# Altium schematic sheet I2C_Switch.SchDoc
size A3; SheetNumber: 35; SheetTotal: 35
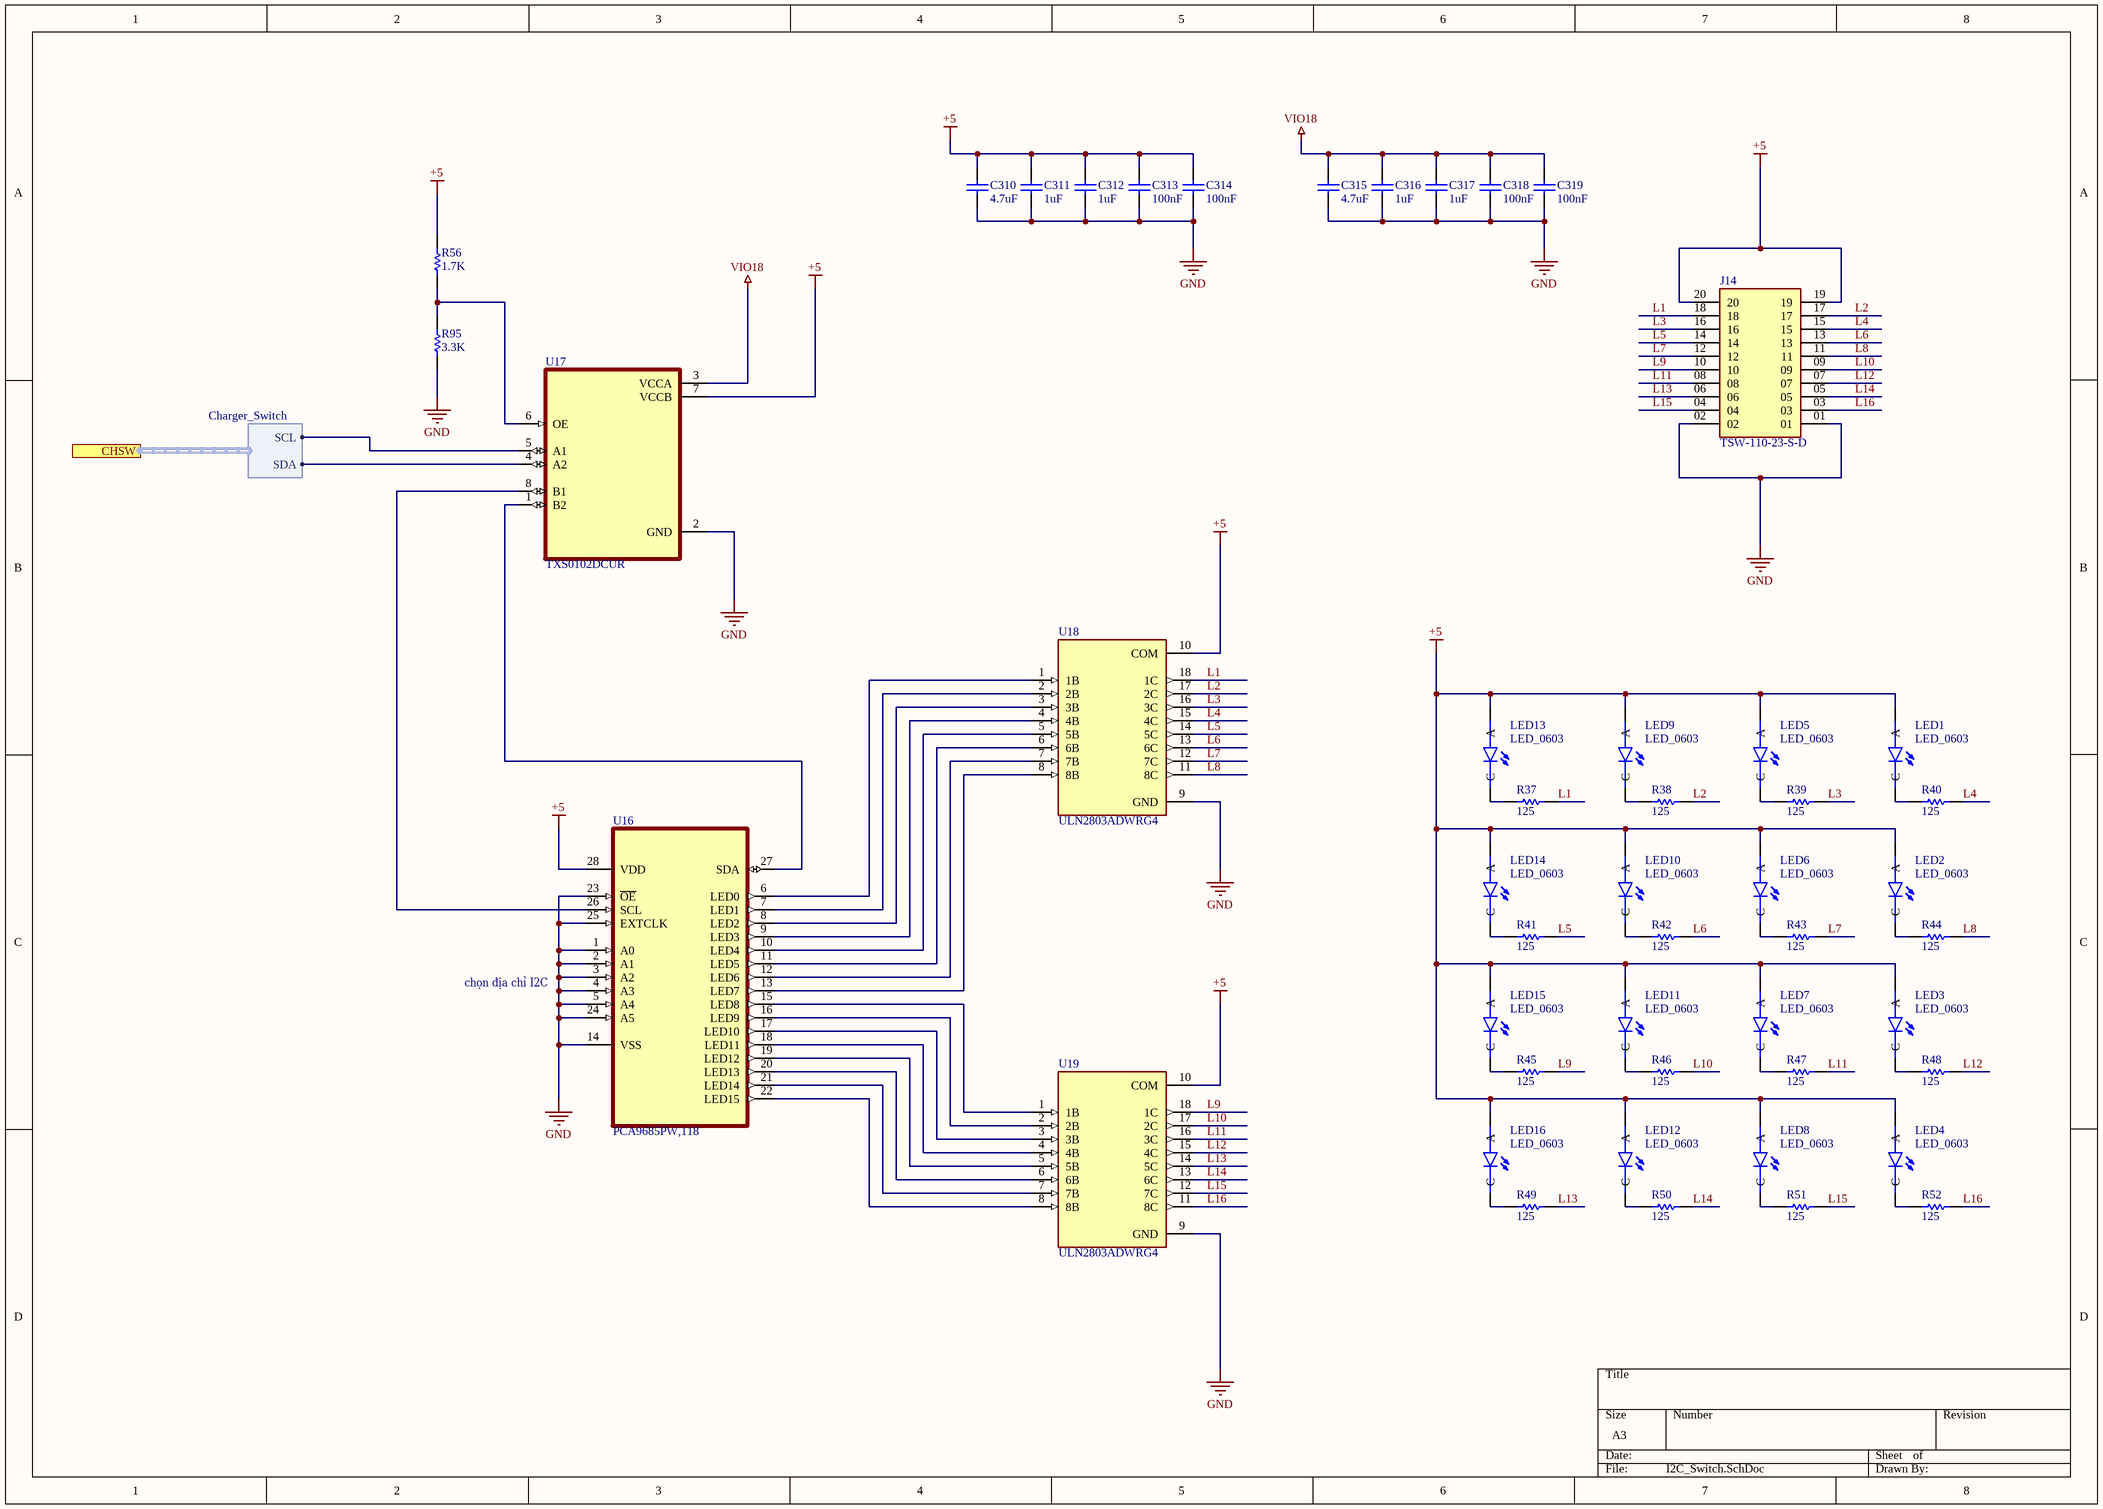
[diagram p0: I2C_Switch.SchDoc]

## Parts
C310  value 4.7uF  [C0805]  (hidden comment: C0805)
C311  value 1uF  [C0805]  (hidden comment: C0805)
C312  value 1uF  [C0805]  (hidden comment: C0805)
C313  value 100nF  [C0603]  (hidden comment: C0603)
C314  value 100nF  [C0603]  (hidden comment: C0603)
C315  value 4.7uF  [C0805]  (hidden comment: C0805)
C316  value 1uF  [C0805]  (hidden comment: C0805)
C317  value 1uF  [C0805]  (hidden comment: C0805)
C318  value 100nF  [C0603]  (hidden comment: C0603)
C319  value 100nF  [C0603]  (hidden comment: C0603)
J14  TSW-110-23-S-D  [SAMTEC_TSW-110-23-S-D]
LED1  LED_0603  [LED_0603]
LED2  LED_0603  [LED_0603]
LED3  LED_0603  [LED_0603]
LED4  LED_0603  [LED_0603]
LED5  LED_0603  [LED_0603]
LED6  LED_0603  [LED_0603]
LED7  LED_0603  [LED_0603]
LED8  LED_0603  [LED_0603]
LED9  LED_0603  [LED_0603]
LED10  LED_0603  [LED_0603]
LED11  LED_0603  [LED_0603]
LED12  LED_0603  [LED_0603]
LED13  LED_0603  [LED_0603]
LED14  LED_0603  [LED_0603]
LED15  LED_0603  [LED_0603]
LED16  LED_0603  [LED_0603]
R37  value 125  [R0603]  (hidden comment: R0603)
R38  value 125  [R0603]  (hidden comment: R0603)
R39  value 125  [R0603]  (hidden comment: R0603)
R40  value 125  [R0603]  (hidden comment: R0603)
R41  value 125  [R0603]  (hidden comment: R0603)
R42  value 125  [R0603]  (hidden comment: R0603)
R43  value 125  [R0603]  (hidden comment: R0603)
R44  value 125  [R0603]  (hidden comment: R0603)
R45  value 125  [R0603]  (hidden comment: R0603)
R46  value 125  [R0603]  (hidden comment: R0603)
R47  value 125  [R0603]  (hidden comment: R0603)
R48  value 125  [R0603]  (hidden comment: R0603)
R49  value 125  [R0603]  (hidden comment: R0603)
R50  value 125  [R0603]  (hidden comment: R0603)
R51  value 125  [R0603]  (hidden comment: R0603)
R52  value 125  [R0603]  (hidden comment: R0603)
R56  value 1.7K  [R0603]  (hidden comment: R0603)
R95  value 3.3K  [R0603]  (hidden comment: R0603)
U16  PCA9685PW,118  [SOP65P640X110-28N]
U17  TXS0102DCUR  [SOP50P310X90-8N]
U18  ULN2803ADWRG4  [SOIC127P1030X265-18N]
U19  ULN2803ADWRG4  [SOIC127P1030X265-18N]

## Ports
CHSW (harness Charger_Switch, see main[8500,1000], Charger_boost_LDO[1400,3400], Power[5300,500])

## Harnesses
Charger_Switch: SCL, SDA

## Nets
+5: C310.2 C311.2 C312.2 C313.2 C314.2 J14.19 J14.20 LED1.A LED2.A LED3.A LED4.A LED5.A LED6.A LED7.A LED8.A LED9.A LED10.A LED11.A LED12.A LED13.A LED14.A LED15.A LED16.A R56.2 U16.28(VDD) U17.7(VCCB) U18.10(COM) U19.10(COM)
GND: C310.1 C311.1 C312.1 C313.1 C314.1 C315.1 C316.1 C317.1 C318.1 C319.1 J14.01 J14.02 R95.1 U16.1(A0) U16.2(A1) U16.3(A2) U16.4(A3) U16.5(A4) U16.14(VSS) U16.23(~{OE}) U16.24(A5) U16.25(EXTCLK) U17.2(GND) U18.9(GND) U19.9(GND)
VIO18: C315.2 C316.2 C317.2 C318.2 C319.2 U17.3(VCCA)
L1: J14.18 R37.2 U18.18(1C)
L2: J14.17 R38.2 U18.17(2C)
L3: J14.16 R39.2 U18.16(3C)
L4: J14.15 R40.2 U18.15(4C)
L5: J14.14 R41.2 U18.14(5C)
L6: J14.13 R42.2 U18.13(6C)
L7: J14.12 R43.2 U18.12(7C)
L8: J14.11 R44.2 U18.11(8C)
L9: J14.10 R45.2 U19.18(1C)
L10: J14.09 R46.2 U19.17(2C)
L11: J14.08 R47.2 U19.16(3C)
L12: J14.07 R48.2 U19.15(4C)
L13: J14.06 R49.2 U19.14(5C)
L14: J14.05 R50.2 U19.13(6C)
L15: J14.04 R51.2 U19.12(7C)
L16: J14.03 R52.2 U19.11(8C)
NetLED1_C: LED1.C R40.1
NetLED2_C: LED2.C R44.1
NetLED3_C: LED3.C R48.1
NetLED4_C: LED4.C R52.1
NetLED5_C: LED5.C R39.1
NetLED6_C: LED6.C R43.1
NetLED7_C: LED7.C R47.1
NetLED8_C: LED8.C R51.1
NetLED9_C: LED9.C R38.1
NetLED10_C: LED10.C R42.1
NetLED11_C: LED11.C R46.1
NetLED12_C: LED12.C R50.1
NetLED13_C: LED13.C R37.1
NetLED14_C: LED14.C R41.1
NetLED15_C: LED15.C R45.1
NetLED16_C: LED16.C R49.1
NetR56_1: R56.1 R95.2 U17.6(OE)
NetU16_6: U16.6(LED0) U18.1(1B)
NetU16_7: U16.7(LED1) U18.2(2B)
NetU16_8: U16.8(LED2) U18.3(3B)
NetU16_9: U16.9(LED3) U18.4(4B)
NetU16_10: U16.10(LED4) U18.5(5B)
NetU16_11: U16.11(LED5) U18.6(6B)
NetU16_12: U16.12(LED6) U18.7(7B)
NetU16_13: U16.13(LED7) U18.8(8B)
NetU16_15: U16.15(LED8) U19.1(1B)
NetU16_16: U16.16(LED9) U19.2(2B)
NetU16_17: U16.17(LED10) U19.3(3B)
NetU16_18: U16.18(LED11) U19.4(4B)
NetU16_19: U16.19(LED12) U19.5(5B)
NetU16_20: U16.20(LED13) U19.6(6B)
NetU16_21: U16.21(LED14) U19.7(7B)
NetU16_22: U16.22(LED15) U19.8(8B)
NetU16_26: U16.26(SCL) U17.8(B1)
NetU16_27: U16.27(SDA) U17.1(B2)
NetU17_4: U17.4(A2) ; port CHSW.SDA
NetU17_5: U17.5(A1) ; port CHSW.SCL

## Notes on the sheet
- (near U16) chọn địa chỉ I2C

## Library data of the parts
J14 = TSW-110-23-S-D: TSW Series .100 Terminal Strip
LED1-LED16 = LED_0603: LED SMD
U16 = PCA9685PW,118: LED Driver IC 16 Output Linear - PWM Dimming 25mA 28-TSSOP
U18 U19 = ULN2803ADWRG4: 50-V, 8-ch darlington array 18-SOIC -40 to 85